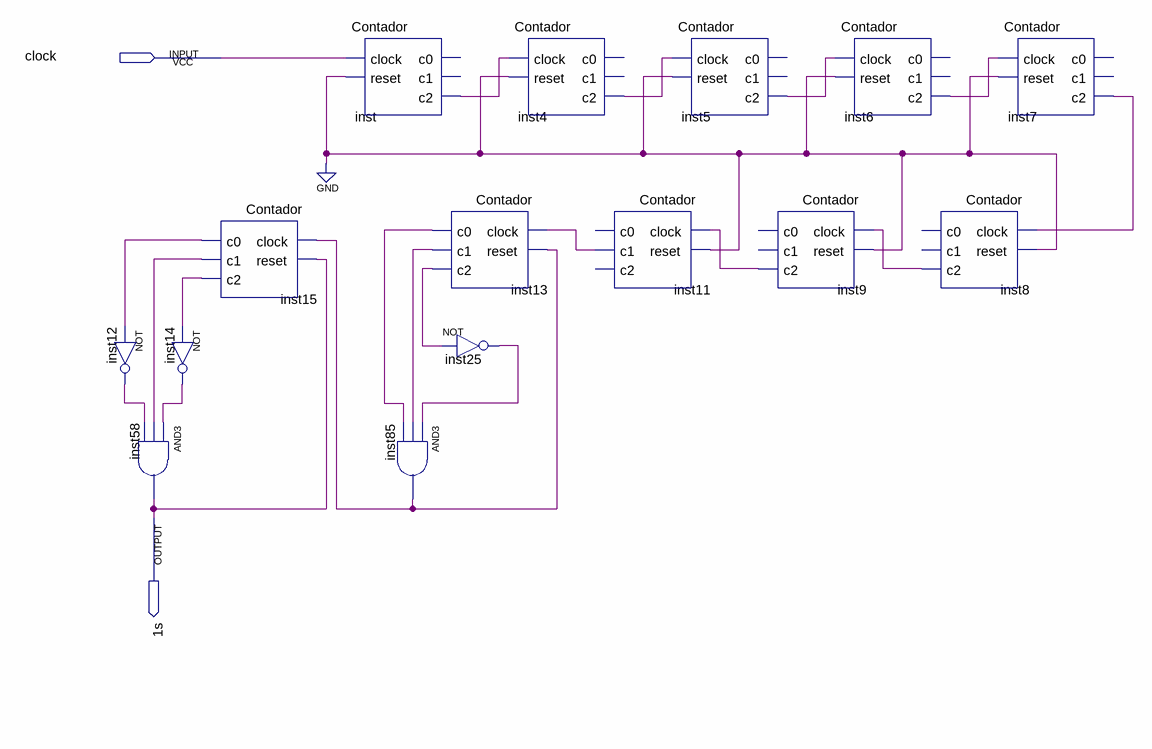
[diagram p0: schematic sheet]
// Quartus schematic Temporizador.bdf as structural Verilog: 15 symbols, 2 pins
module Temporizador (
  input  clock,
  output \1s 
);

  wire inst4_c2, inst5_c2, inst6_c2, inst7_c2, inst8_c2, inst9_c2, inst11_c1, inst12_out, inst13_c0,
       inst13_c1, inst13_c2, inst14_out, inst15_c0, inst15_c1, inst15_c2, inst25_out, inst85_out, inst_c2;

  not inst14 (inst14_out, inst15_c2);
  not inst12 (inst12_out, inst15_c0);
  and inst58 (\1s , inst14_out, inst15_c1, inst12_out);
  Contador inst15 (.clock(inst85_out), .reset(\1s ), .c0(inst15_c0), .c1(inst15_c1), .c2(inst15_c2));
  Contador inst (.clock(clock), .reset(1'b0), .c2(inst_c2));  // open: c0, c1
  and inst85 (inst85_out, inst25_out, inst13_c1, inst13_c0);
  Contador inst13 (.clock(inst11_c1), .reset(inst85_out), .c0(inst13_c0), .c1(inst13_c1), .c2(inst13_c2));
  not inst25 (inst25_out, inst13_c2);
  Contador inst4 (.clock(inst_c2), .reset(1'b0), .c2(inst4_c2));  // open: c0, c1
  Contador inst11 (.clock(inst9_c2), .reset(1'b0), .c1(inst11_c1));  // open: c0, c2
  Contador inst5 (.clock(inst4_c2), .reset(1'b0), .c2(inst5_c2));  // open: c0, c1
  Contador inst9 (.clock(inst8_c2), .reset(1'b0), .c2(inst9_c2));  // open: c0, c1
  Contador inst6 (.clock(inst5_c2), .reset(1'b0), .c2(inst6_c2));  // open: c0, c1
  Contador inst8 (.clock(inst7_c2), .reset(1'b0), .c2(inst8_c2));  // open: c0, c1
  Contador inst7 (.clock(inst6_c2), .reset(1'b0), .c2(inst7_c2));  // open: c0, c1
endmodule
